# EasyEDA schematic smart-nixie_easyeda_project_backup.json
TITLE: smart-nixie; REV: 1.0; Date: 2020-08-06; Sheet: 1/1; Drawn By: dbene; Company: https://github.com/danielbene
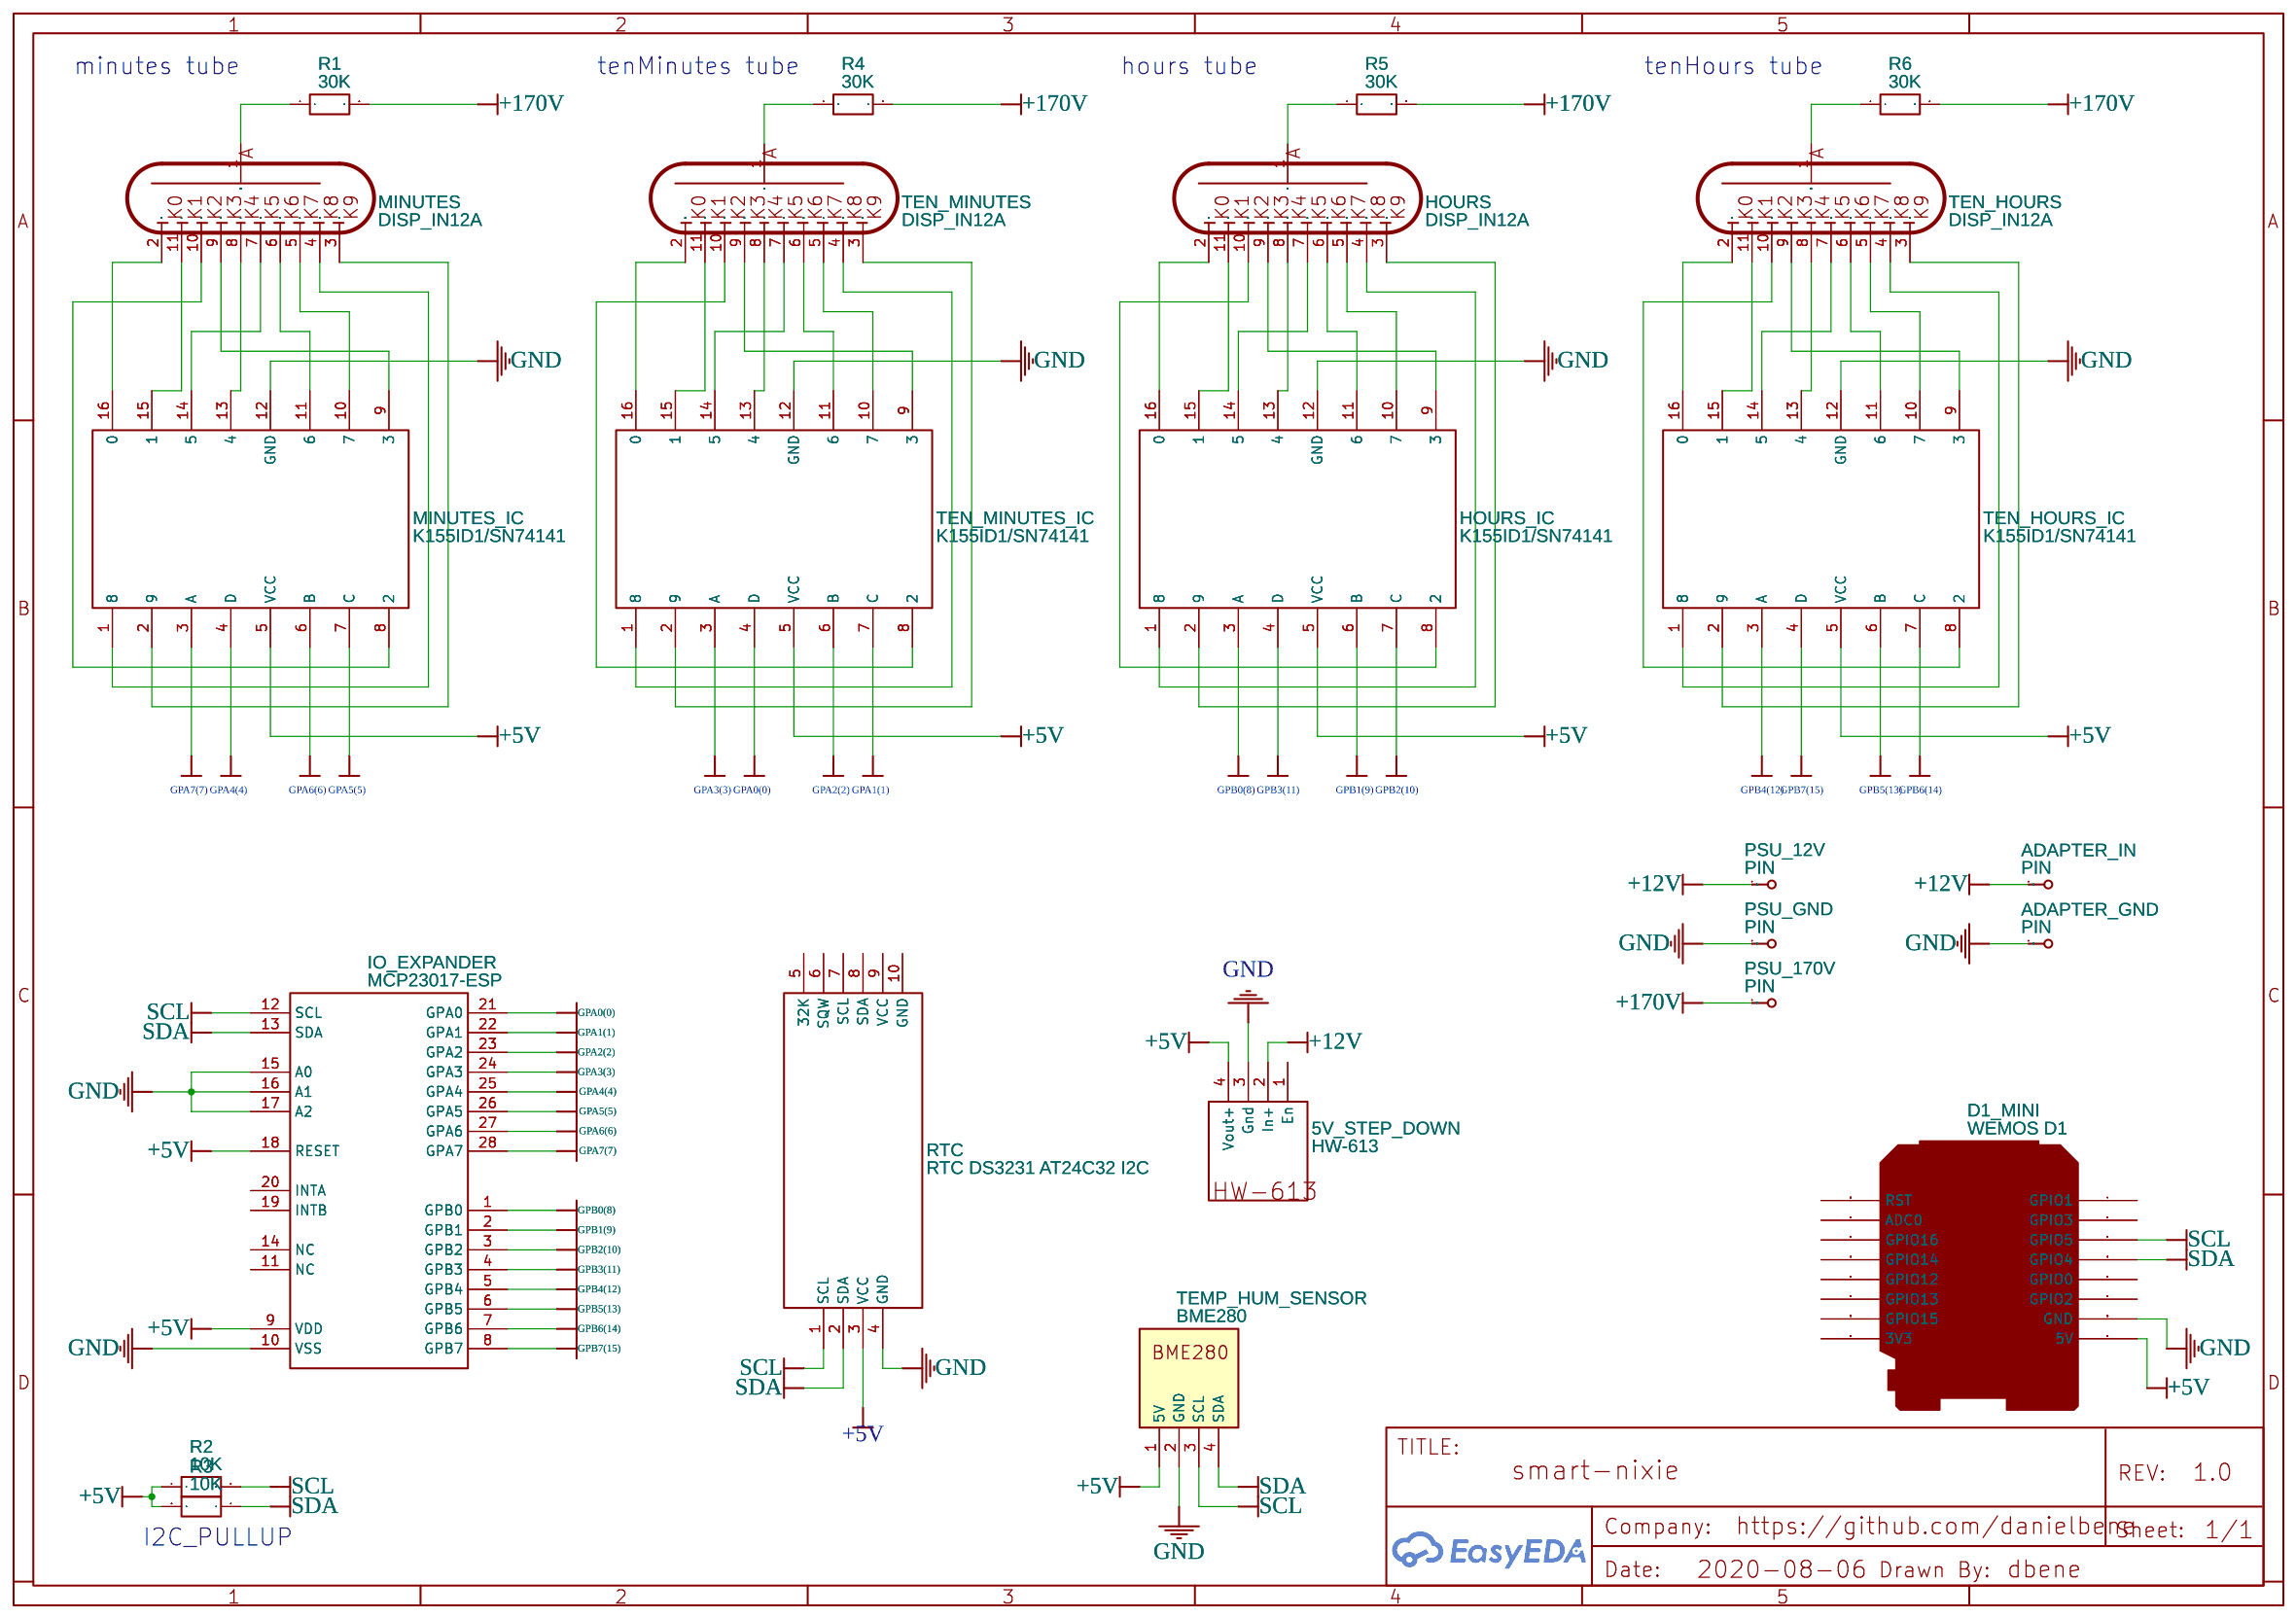
[diagram p0: schematic sheet]

## Parts
5V_STEP_DOWN  HW-613  [HW-613]
ADAPTER_GND  PIN  [PTH_39MIL]
ADAPTER_IN  PIN  [PTH_39MIL]
D1_MINI  WEMOS D1  [WEMOS_D1_MINI_V2.3.0]
HOURS  DISP_IN12A  [DISP_IN-12_SOCKET]
HOURS_IC  K155ID1/SN74141  [DIP16]
IO_EXPANDER  MCP23017-ESP  [DIP28]
MINUTES  DISP_IN12A  [DISP_IN-12_SOCKET]
MINUTES_IC  K155ID1/SN74141  [DIP16]
PSU_12V  PIN  [PTH_39MIL]
PSU_170V  PIN  [PTH_39MIL]
PSU_GND  PIN  [PTH_39MIL]
R1  30K  [RES-TH_BD2.4-L6.3-P10.30-D0.6]
R2  10K  [RES-TH_BD2.4-L6.3-P10.30-D0.6]
R3  10K  [RES-TH_BD2.4-L6.3-P10.30-D0.6]
R4  30K  [RES-TH_BD2.4-L6.3-P10.30-D0.6]
R5  30K  [RES-TH_BD2.4-L6.3-P10.30-D0.6]
R6  30K  [RES-TH_BD2.4-L6.3-P10.30-D0.6]
RTC  RTC DS3231 AT24C32 I2C  [RTC DS3231 AT24C32 I2C]
TEMP_HUM_SENSOR  BME280  [BME280 I2C]
TEN_HOURS  DISP_IN12A  [DISP_IN-12_SOCKET]
TEN_HOURS_IC  K155ID1/SN74141  [DIP16]
TEN_MINUTES  DISP_IN12A  [DISP_IN-12_SOCKET]
TEN_MINUTES_IC  K155ID1/SN74141  [DIP16]

## Library data of the parts
5V_STEP_DOWN = HW-613: Contributor: guenno
ADAPTER_GND ADAPTER_IN PSU_12V PSU_170V PSU_GND = PIN: null
D1_MINI = WEMOS D1: Manufacturer: Wemos; Contributor: romax.job
HOURS MINUTES TEN_HOURS TEN_MINUTES = DISP_IN12A: IN-12A Nixie Display; Contributor: DangerousPrototype
HOURS_IC MINUTES_IC TEN_HOURS_IC TEN_MINUTES_IC = K155ID1/SN74141: Contributor: Sjoertdb
IO_EXPANDER = MCP23017-ESP: 16-Bit IO Expander with Serial Interface, 28-Pin SPDIP, Extended Temperature
R1 R4-R6 = RD 1/4W 30K J T/B A1: Supplier: LCSC; Supplier Part: C433733; Manufacturer: TyoHM; Contributor: LCSC
R2 R3 = RD 1/4W 10K J T/B A1: Supplier: LCSC; Supplier Part: C433778; Manufacturer: TyoHM; Contributor: LCSC
RTC = RTC DS3231 AT24C32 I2C: sourceId: Bx3XewqI0; Contributor: Thiago Silva
TEMP_HUM_SENSOR = BME280: sourceId: vBbLlUSQ2

## Nets
+5V: 5V_STEP_DOWN.4(Vout+) D1_MINI.5V HOURS_IC.5(VCC) IO_EXPANDER.9(VDD) IO_EXPANDER.18(RESET) MINUTES_IC.5(VCC) R2.1 R3.2 RTC.3(VCC) TEMP_HUM_SENSOR.1(5V) TEN_HOURS_IC.5(VCC) TEN_MINUTES_IC.5(VCC)
+12V: 5V_STEP_DOWN.2(In+) ADAPTER_IN.1(P$1) PSU_12V.1(P$1)
+170V: PSU_170V.1(P$1) R1.2 R4.2 R5.2 R6.2
GND: 5V_STEP_DOWN.3(Gnd) ADAPTER_GND.1(P$1) D1_MINI.GND HOURS_IC.12(GND) IO_EXPANDER.10(VSS) IO_EXPANDER.15(A0) IO_EXPANDER.16(A1) IO_EXPANDER.17(A2) MINUTES_IC.12(GND) PSU_GND.1(P$1) RTC.4(GND) TEMP_HUM_SENSOR.2(GND) TEN_HOURS_IC.12(GND) TEN_MINUTES_IC.12(GND)
GPA0(0): IO_EXPANDER.21(GPA0) TEN_MINUTES_IC.4(D)
GPA1(1): IO_EXPANDER.22(GPA1) TEN_MINUTES_IC.7(C)
GPA2(2): IO_EXPANDER.23(GPA2) TEN_MINUTES_IC.6(B)
GPA3(3): IO_EXPANDER.24(GPA3) TEN_MINUTES_IC.3(A)
GPA4(4): IO_EXPANDER.25(GPA4) MINUTES_IC.4(D)
GPA5(5): IO_EXPANDER.26(GPA5) MINUTES_IC.7(C)
GPA6(6): IO_EXPANDER.27(GPA6) MINUTES_IC.6(B)
GPA7(7): IO_EXPANDER.28(GPA7) MINUTES_IC.3(A)
GPB0(8): HOURS_IC.3(A) IO_EXPANDER.1(GPB0)
GPB1(9): HOURS_IC.6(B) IO_EXPANDER.2(GPB1)
GPB2(10): HOURS_IC.7(C) IO_EXPANDER.3(GPB2)
GPB3(11): HOURS_IC.4(D) IO_EXPANDER.4(GPB3)
GPB4(12): IO_EXPANDER.5(GPB4) TEN_HOURS_IC.3(A)
GPB5(13): IO_EXPANDER.6(GPB5) TEN_HOURS_IC.6(B)
GPB6(14): IO_EXPANDER.7(GPB6) TEN_HOURS_IC.7(C)
GPB7(15): IO_EXPANDER.8(GPB7) TEN_HOURS_IC.4(D)
SCL: D1_MINI.D1(GPIO5) IO_EXPANDER.12(SCL) R2.2 RTC.1(SCL) TEMP_HUM_SENSOR.3(SCL)
SDA: D1_MINI.D2(GPIO14) IO_EXPANDER.13(SDA) R3.1 RTC.2(SDA) TEMP_HUM_SENSOR.4(SDA)
Net-(HOURS-1): HOURS.1(ANODE) R5.1
Net-(HOURS-2): HOURS.2(K0) HOURS_IC.16(0)
Net-(HOURS-3): HOURS.3(K9) HOURS_IC.2(9)
Net-(HOURS-4): HOURS.4(K8) HOURS_IC.1(8)
Net-(HOURS-5): HOURS.5(K7) HOURS_IC.10(7)
Net-(HOURS-6): HOURS.6(K6) HOURS_IC.11(6)
Net-(HOURS-7): HOURS.7(K5) HOURS_IC.14(5)
Net-(HOURS-8): HOURS.8(K4) HOURS_IC.13(4)
Net-(HOURS-9): HOURS.9(K3) HOURS_IC.9(3)
Net-(HOURS-10): HOURS.10(K2) HOURS_IC.8(2)
Net-(HOURS-11): HOURS.11(K1) HOURS_IC.15(1)
Net-(MINUTES-1): MINUTES.1(ANODE) R1.1
Net-(MINUTES-2): MINUTES.2(K0) MINUTES_IC.16(0)
Net-(MINUTES-3): MINUTES.3(K9) MINUTES_IC.2(9)
Net-(MINUTES-4): MINUTES.4(K8) MINUTES_IC.1(8)
Net-(MINUTES-5): MINUTES.5(K7) MINUTES_IC.10(7)
Net-(MINUTES-6): MINUTES.6(K6) MINUTES_IC.11(6)
Net-(MINUTES-7): MINUTES.7(K5) MINUTES_IC.14(5)
Net-(MINUTES-8): MINUTES.8(K4) MINUTES_IC.13(4)
Net-(MINUTES-9): MINUTES.9(K3) MINUTES_IC.9(3)
Net-(MINUTES-10): MINUTES.10(K2) MINUTES_IC.8(2)
Net-(MINUTES-11): MINUTES.11(K1) MINUTES_IC.15(1)
Net-(R4-1): R4.1 TEN_MINUTES.1(ANODE)
Net-(R6-1): R6.1 TEN_HOURS.1(ANODE)
Net-(TEN_HOURS-2): TEN_HOURS.2(K0) TEN_HOURS_IC.16(0)
Net-(TEN_HOURS-3): TEN_HOURS.3(K9) TEN_HOURS_IC.2(9)
Net-(TEN_HOURS-4): TEN_HOURS.4(K8) TEN_HOURS_IC.1(8)
Net-(TEN_HOURS-5): TEN_HOURS.5(K7) TEN_HOURS_IC.10(7)
Net-(TEN_HOURS-6): TEN_HOURS.6(K6) TEN_HOURS_IC.11(6)
Net-(TEN_HOURS-7): TEN_HOURS.7(K5) TEN_HOURS_IC.14(5)
Net-(TEN_HOURS-8): TEN_HOURS.8(K4) TEN_HOURS_IC.13(4)
Net-(TEN_HOURS-9): TEN_HOURS.9(K3) TEN_HOURS_IC.9(3)
Net-(TEN_HOURS-10): TEN_HOURS.10(K2) TEN_HOURS_IC.8(2)
Net-(TEN_HOURS-11): TEN_HOURS.11(K1) TEN_HOURS_IC.15(1)
Net-(TEN_MINUTES-2): TEN_MINUTES.2(K0) TEN_MINUTES_IC.16(0)
Net-(TEN_MINUTES-3): TEN_MINUTES.3(K9) TEN_MINUTES_IC.2(9)
Net-(TEN_MINUTES-4): TEN_MINUTES.4(K8) TEN_MINUTES_IC.1(8)
Net-(TEN_MINUTES-5): TEN_MINUTES.5(K7) TEN_MINUTES_IC.10(7)
Net-(TEN_MINUTES-6): TEN_MINUTES.6(K6) TEN_MINUTES_IC.11(6)
Net-(TEN_MINUTES-7): TEN_MINUTES.7(K5) TEN_MINUTES_IC.14(5)
Net-(TEN_MINUTES-8): TEN_MINUTES.8(K4) TEN_MINUTES_IC.13(4)
Net-(TEN_MINUTES-9): TEN_MINUTES.9(K3) TEN_MINUTES_IC.9(3)
Net-(TEN_MINUTES-10): TEN_MINUTES.10(K2) TEN_MINUTES_IC.8(2)
Net-(TEN_MINUTES-11): TEN_MINUTES.11(K1) TEN_MINUTES_IC.15(1)

Not connected (* = marked no-connect by the designer): 5V_STEP_DOWN 1(En); D1_MINI 3V3 A0(ADC0) D0(GPIO16) D3(GPIO0) D4(GPIO2) D6(GPIO12) D7(GPIO13) D8(GPIO15) RST RX(GPIO3) TX(GPIO1); IO_EXPANDER 11(NC) 14(NC) 19(INTB) 20(INTA); RTC 5(32K) 6(SQW) 7(SCL) 8(SDA) 9(VCC) 10(GND)

## Notes on the sheet
- minutes tube
- tenMinutes tube
- hours tube
- tenHours tube
- I2C_PULLUP
